# Altium schematic sheet AdcPmodWM8782.SchDoc
size A4
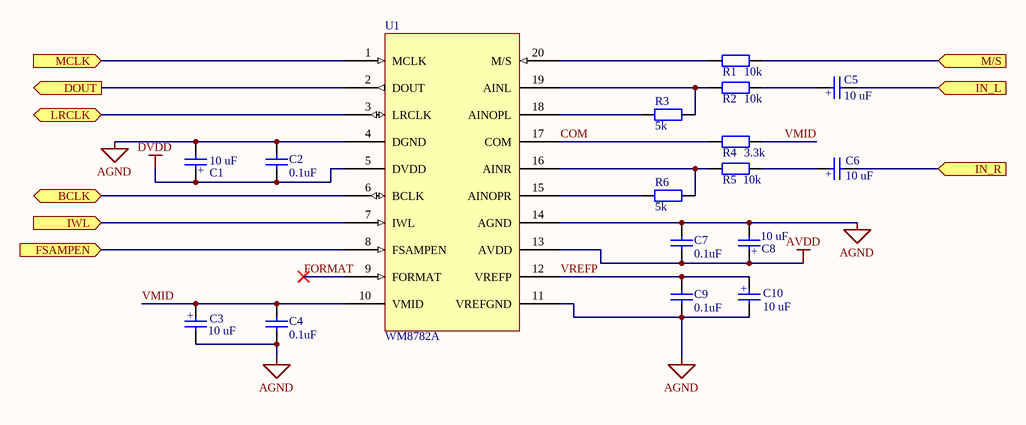
[diagram p0: AdcPmodWM8782.SchDoc]

## Parts
C1  10 uF  [CAP_POL1206]
C2  0.1uF  [CAP0805]
C3  10 uF  [CAP_POL1206]
C4  0.1uF  [CAP0805]
C5  10 uF  [CAP EL SMD Dia. 5mm]
C6  10 uF  [CAP EL SMD Dia. 5mm]
C7  0.1uF  [CAP0805]
C8  10 uF  [CAP_POL1206]
C9  0.1uF  [CAP0805]
C10  10 uF  [CAP_POL1206]
R1  10k  [RES0805]
R2  10k  [RES0805]
R3  5k  [RES0805]
R4  3.3k  [RES0805]
R5  10k  [RES0805]
R6  5k  [RES0805]
U1  WM8782A  [SSOP16 5.3mm]

## Ports
BCLK, DOUT (out), FSAMPEN (in), IN_L (in), IN_R (in), IWL (in), LRCLK (bidir), M/S (in), MCLK (in)

## Nets
AGND: C1.2 C2.2 C3.2 C4.1 C7.2 C8.2 C9.1 C10.2 U1.4(DGND) U1.11(VREFGND) U1.14(AGND)
AVDD: C7.1 C8.1 U1.13(AVDD)
DVDD: C1.1 C2.1 U1.5(DVDD)
BCLK: U1.6(BCLK) ; port BCLK
COM: R4.1 U1.17(COM)
DOUT: U1.2(DOUT) ; port DOUT
FORMAT: U1.9(FORMAT)
FSAMPEN: U1.8(FSAMPEN) ; port FSAMPEN
IN_L: C5.2 ; port IN_L
IN_R: C6.2 ; port IN_R
IWL: U1.7(IWL) ; port IWL
LRCLK: U1.3(LRCLK) ; port LRCLK
M/S: R1.2 ; port M/S
MCLK: U1.1(MCLK) ; port MCLK
VMID: C3.1 C4.2 R4.2 U1.10(VMID)
VREFP: C9.2 C10.1 U1.12(VREFP)
NetC5_1: C5.1 R2.1
NetC6_1: C6.1 R5.2
NetR1_1: R1.1 U1.20(M/S)
NetR2_2: R2.2 R3.2 U1.19(AINL)
NetR3_1: R3.1 U1.18(AINOPL)
NetR5_1: R5.1 R6.2 U1.16(AINR)
NetR6_1: R6.1 U1.15(AINOPR)

## Notes on the sheet
- (in symbol CAP_POL) +

## Library data of the parts
C1 C3 C8 C10 = CAP_POL: Capacitor Tantalum - Polymer; Manufacturer: Vishay / Polytech; Mfr. Part No.: T55A106M010C0200; Suplier Part No.: 74-T55A106M010C0200; Voltage Rating: 10 VDC; Value: 10 uF; Supplier: Mouser
C2 C4 C7 C9 = CAP: Ceramic X7R; Manufacturer: AVX; Mfr. Part No.: 08055C104KAT2A; Suplier Part No.: 581-08055C104K; Value: 0.1uF; Supplier: Mouser
C5 C6 = CAP_POL: Electrolytic; Manufacturer: United Chemi-Con; Mfr. Part No.: EMZJ250ADA220ME61G; Suplier Part No.: 661-EMZJ250A220ME61G; Value: 10 uF; Supplier: Mouser
R1 R2 R5 = RES: Thin Film; Manufacturer: Vishay; Mfr. Part No.: TNPW080510K0FEEA; Suplier Part No.: 71-TNPW080510K0FEEA; Value: 10k; Supplier: Mouser
R3 R6 = RES: Thin Film; Manufacturer: Vishay; Mfr. Part No.: TNPW12065K00BEEN; Suplier Part No.: 71-TNPW12065K00BEEN; Value: 5k; Supplier: Mouser
R4 = RES: Resistor; Value: 3.3k
U1 = WM8782: 24-Bit, 192 kHz Stereo ADC; Manufacturer: Cirrus Logic; Mfr. Part No.: WM8782SEDS/V; Suplier Part No.: 238-WM8782SEDS/V; Supplier: Mouser